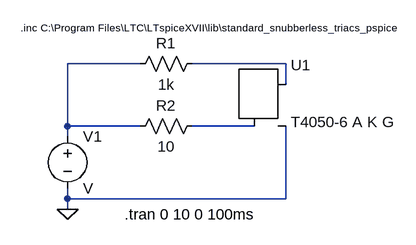
[diagram p0: schematic Shubham Rattra _ UE185112 _ exp4.asc]
Shubham Rattra _ UE185112 _ exp4.asc, the LTspice schematic file:
Version 4
SHEET 1 880 680
WIRE 192 96 80 96
WIRE 416 96 272 96
WIRE 416 128 416 96
WIRE 80 192 80 96
WIRE 192 192 80 192
WIRE 368 192 272 192
WIRE 80 208 80 192
WIRE 80 304 80 288
WIRE 416 304 416 192
WIRE 416 304 80 304
WIRE 80 320 80 304
FLAG 80 320 0
SYMBOL Misc\\TRIAC 384 128 R0
SYMATTR InstName U1
SYMATTR Value T4050-6 A K G
SYMBOL res 288 80 R90
WINDOW 0 0 56 VBottom 2
WINDOW 3 32 56 VTop 2
SYMATTR InstName R1
SYMATTR Value 1k
SYMBOL res 288 176 R90
WINDOW 0 0 56 VBottom 2
WINDOW 3 32 56 VTop 2
SYMATTR InstName R2
SYMATTR Value 10
SYMBOL voltage 80 192 R0
SYMATTR InstName V1
TEXT 168 328 Left 2 !.tran 0 10 0 100ms
TEXT 8 40 Left 1 !.inc C:\\Program Files\\LTC\\LTspiceXVII\\lib\\standard_snubberless_triacs_pspice

The netlist it stands for:
* Shubham Rattra _ UE185112 _ exp4.asc
XU1 N002 N003 0 T4050-6 A K G  ; pins MT2 G MT1
R1 N002 N001 1k
R2 N003 N001 10
V1 N001 0 V
.tran 0 10 0 100ms
.inc C:\Program Files\LTC\LTspiceXVII\lib\standard_snubberless_triacs_pspice
.backanno
.end